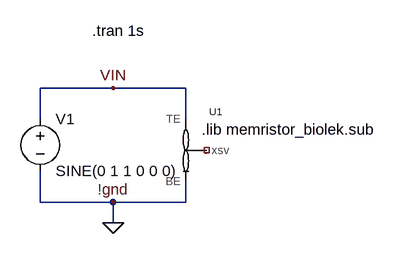
[diagram p0: schematic exp-1_0.asc]
exp-1_0.asc, the LTspice schematic file:
Version 4
SHEET 1 880 680
WIRE 208 80 96 80
WIRE 320 80 208 80
WIRE 96 128 96 80
WIRE 320 128 320 80
WIRE 96 256 96 208
WIRE 208 256 96 256
WIRE 320 256 320 224
WIRE 320 256 208 256
WIRE 208 288 208 256
FLAG 208 80 VIN
FLAG 208 288 0
FLAG 208 256 !gnd
SYMBOL memristor_with_state 320 176 R0
SYMATTR InstName U1
SYMATTR Value MEM_BIOLEK_WILLIAN
SYMBOL voltage 96 112 R0
WINDOW 123 0 0 Left 0
WINDOW 39 0 0 Left 0
SYMATTR InstName V1
SYMATTR Value SINE(0 1 1 0 0 0)
TEXT 176 -8 Left 2 !.tran 1s
TEXT 344 144 Left 2 !.lib memristor_biolek.sub

The netlist it stands for:
* exp-1_0.asc
XU1 VIN 0 NC_01 MEM_BIOLEK_WILLIAN  ; pins TE BE xsv
V1 VIN 0 SINE(0 1 1 0 0 0)
.tran 1s
.lib memristor_biolek.sub
.backanno
.end

* Results of the author's LTspice run, read from the files saved beside the schematic
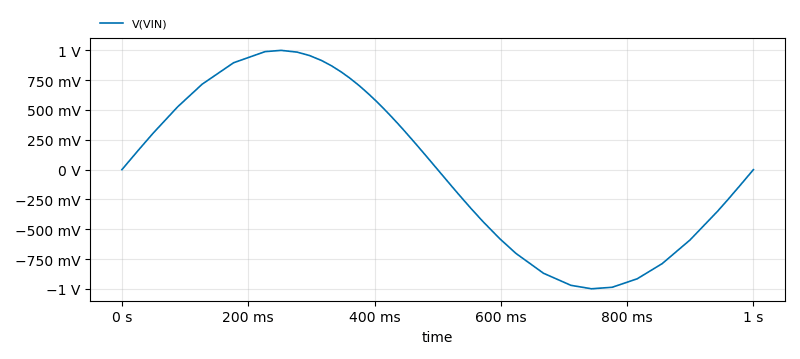
[diagram p1: Transient Analysis of exp-1_0.asc, plotted from the saved traces]
* Transient Analysis, 1 run:
*   V(VIN): min -999.2 mV, max 999.9 mV, average 346.1 µV, rms 706 mV, last 0 V